# Altium schematic sheet Top Level.SchDoc
size A4
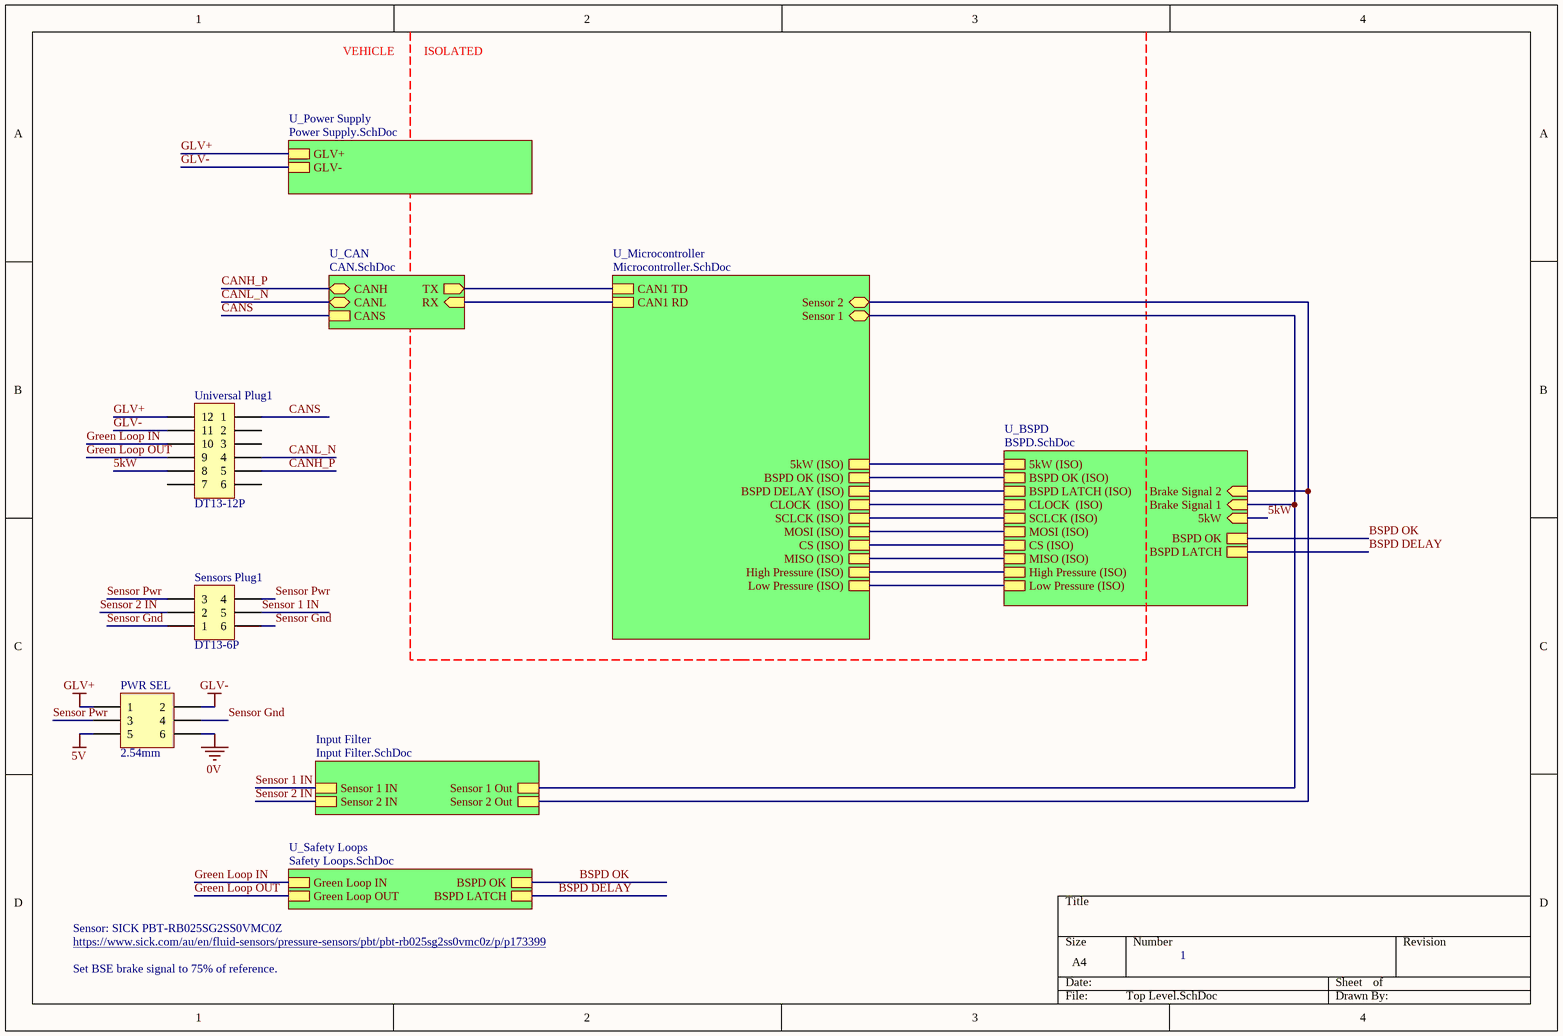
[diagram p0: Top Level.SchDoc]

## Parts
PWR_SEL  2.54mm  [TH 2.54mm Header 2x3]
Sensors_Plug1  DT13-6P  [DT13-6P]
Universal_Plug1  DT13-12P  [DT13-12P]

## Sub-sheets
Input Filter = Input Filter.SchDoc: Sensor 2 IN, Sensor 1 IN, Sensor 2 Out, Sensor 1 Out
U_BSPD = BSPD.SchDoc: BSPD OK (ISO), MOSI (ISO), SCLCK (ISO), 5kW (ISO), Brake Signal 1 (in), Brake Signal 2 (in), BSPD LATCH (ISO), 5kW (in), CLOCK  (ISO), CS (ISO), High Pressure (ISO), Low Pressure (ISO), BSPD OK, BSPD LATCH, MISO (ISO)
U_CAN = CAN.SchDoc: CANS, RX (in), CANL (bidir), CANH (bidir), TX (out)
U_Microcontroller = Microcontroller.SchDoc: BSPD OK (ISO), 5kW (ISO), Sensor 2 (bidir), Sensor 1 (bidir), BSPD DELAY (ISO), CAN1 RD, CAN1 TD, CLOCK  (ISO), High Pressure (ISO), Low Pressure (ISO), MISO (ISO), CS (ISO), MOSI (ISO), SCLCK (ISO)
U_Power Supply = Power Supply.SchDoc: GLV+, GLV-
U_Safety Loops = Safety Loops.SchDoc: Green Loop OUT, Green Loop IN, BSPD OK, BSPD LATCH

## Nets
0V: PWR_SEL.6
5V: PWR_SEL.5
GLV+: PWR_SEL.1 Universal_Plug1.12 ; sheet U_Power Supply/GLV+
GLV-: PWR_SEL.2 Universal_Plug1.11 ; sheet U_Power Supply/GLV-
5kW: Universal_Plug1.8 ; sheet U_BSPD/5kW
BSPD DELAY: sheet U_BSPD/BSPD LATCH, sheet U_Safety Loops/BSPD LATCH
BSPD OK: sheet U_BSPD/BSPD OK, sheet U_Safety Loops/BSPD OK
CANH_P: Universal_Plug1.5 ; sheet U_CAN/CANH
CANL_N: Universal_Plug1.4 ; sheet U_CAN/CANL
CANS: Universal_Plug1.1 ; sheet U_CAN/CANS
Green Loop IN: Universal_Plug1.10 ; sheet U_Safety Loops/Green Loop IN
Green Loop OUT: Universal_Plug1.9 ; sheet U_Safety Loops/Green Loop OUT
Sensor 1 IN: Sensors_Plug1.5 ; sheet Input Filter/Sensor 1 IN
Sensor 2 IN: Sensors_Plug1.2 ; sheet Input Filter/Sensor 2 IN
Sensor Gnd: PWR_SEL.4 Sensors_Plug1.1 Sensors_Plug1.6
Sensor Pwr: PWR_SEL.3 Sensors_Plug1.3 Sensors_Plug1.4
(unnamed): sheet U_BSPD/BSPD OK (ISO), sheet U_Microcontroller/BSPD OK (ISO)
(unnamed): sheet U_BSPD/MOSI (ISO), sheet U_Microcontroller/MOSI (ISO)
(unnamed): sheet U_BSPD/SCLCK (ISO), sheet U_Microcontroller/SCLCK (ISO)
(unnamed): sheet U_BSPD/5kW (ISO), sheet U_Microcontroller/5kW (ISO)
(unnamed): sheet U_BSPD/Brake Signal 1, sheet U_Microcontroller/Sensor 1, sheet Input Filter/Sensor 1 Out
(unnamed): sheet U_BSPD/Brake Signal 2, sheet U_Microcontroller/Sensor 2, sheet Input Filter/Sensor 2 Out
(unnamed): sheet U_BSPD/BSPD LATCH (ISO), sheet U_Microcontroller/BSPD DELAY (ISO)
(unnamed): sheet U_BSPD/CLOCK  (ISO), sheet U_Microcontroller/CLOCK  (ISO)
(unnamed): sheet U_BSPD/CS (ISO), sheet U_Microcontroller/CS (ISO)
(unnamed): sheet U_BSPD/High Pressure (ISO), sheet U_Microcontroller/High Pressure (ISO)
(unnamed): sheet U_BSPD/Low Pressure (ISO), sheet U_Microcontroller/Low Pressure (ISO)
(unnamed): sheet U_BSPD/MISO (ISO), sheet U_Microcontroller/MISO (ISO)
(unnamed): sheet U_Microcontroller/CAN1 RD, sheet U_CAN/RX
(unnamed): sheet U_Microcontroller/CAN1 TD, sheet U_CAN/TX

Not connected (* = marked no-connect by the designer): Universal_Plug1 2 3 6 7

## Notes on the sheet
- VEHICLE
- ISOLATED
- Sensor: SICK PBT-RB025SG2SS0VMC0Z
- https://www.sick.com/au/en/fluid-sensors/pressure-sensors/pbt/pbt-rb025sg2ss0vmc0z/p/p173399
- Set BSE brake signal to 75% of reference.
- 1

## Library data of the parts
PWR_SEL = TH 2.54mm Header 2x3: Positions: 6; Angle: 0; Flange: No; Contact: NA; Part Number: TH 2.54mm Header 2x3; Pitch: 2.54mm; Row Spacing: 2.54mm
Sensors_Plug1 = DT13-6P[[/\]]DT13-6P: Positions: 6; Pitch: 4.44mm; Row Spacing: 6.35mm; Angle: 90; Flange: Yes; Contact: Copper Alloy; Part Number: DT13-6P; Digikey Part Number: 1734-1025-ND; Digikey Link: https://www.digikey.com/product-detail/en/te-connectivity-deutsch-connectors/DT13-6P/1734-1025-ND/6566589
Universal_Plug1 = DT13-12P[[/\]]DT13-12P: Positions: 12; Pitch: 4.44mm; Row Spacing: 6.35mm; Angle: 90; Flange: Yes; Contact: Nickel; Part Number: DT13-12P; Digikey Part Number: 1734-1451-ND; Digikey Link: https://www.digikey.com.au/product-detail/en/te-connectivity-deutsch-connectors/DT13-12PA/1734-1451-ND/7220123